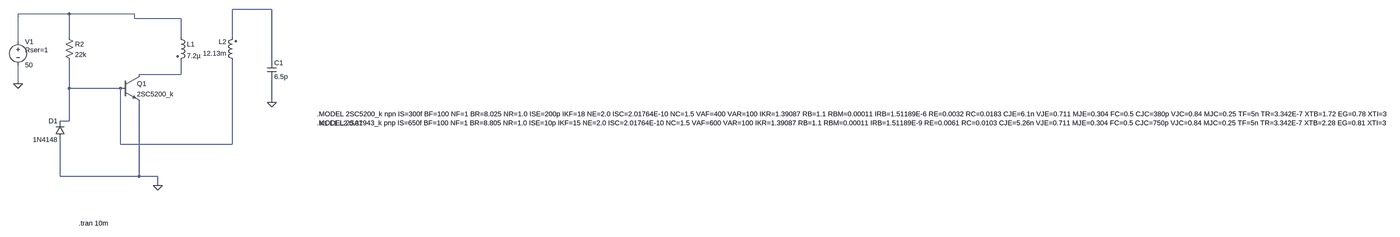
[diagram p0: schematic Tesla coil_simulation.asc, whole sheet]
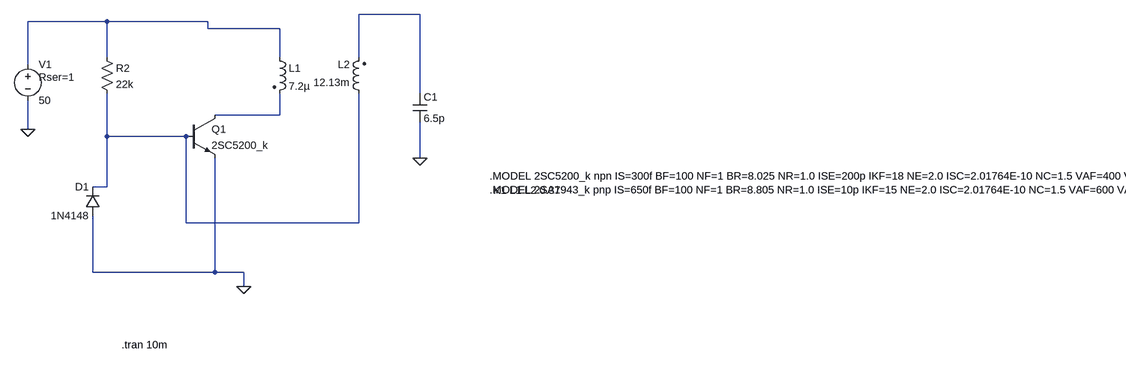
[diagram p1: schematic Tesla coil_simulation.asc, part, row 1 of 1, column 1 of 2]
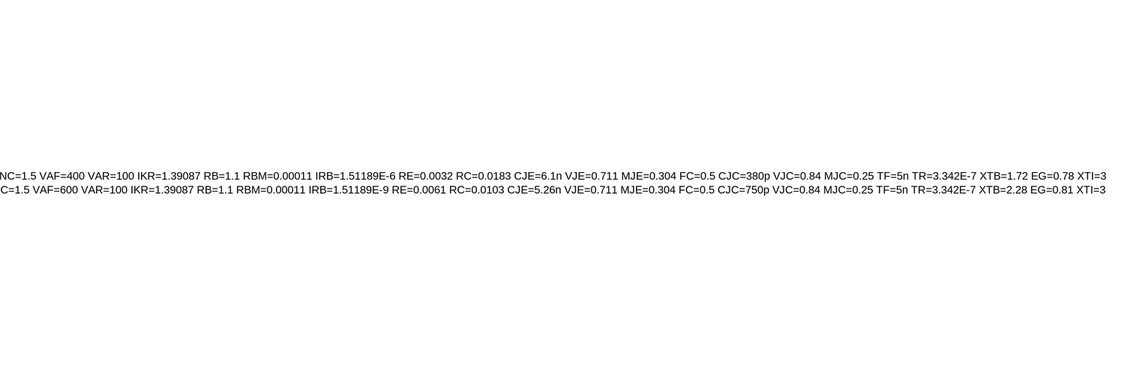
[diagram p2: schematic Tesla coil_simulation.asc, part, row 1 of 1, column 2 of 2]
Tesla coil_simulation.asc, the LTspice schematic file:
Version 4
SHEET 1 4876 680
WIRE 784 -400 640 -400
WIRE 80 -384 -96 -384
WIRE 304 -384 80 -384
WIRE 304 -368 304 -384
WIRE 464 -368 304 -368
WIRE 80 -304 80 -384
WIRE 464 -304 464 -368
WIRE 640 -304 640 -400
WIRE -96 -288 -96 -384
WIRE 784 -224 784 -400
WIRE 464 -176 464 -224
WIRE 464 -176 320 -176
WIRE -96 -144 -96 -208
WIRE 80 -128 80 -224
WIRE 256 -128 80 -128
WIRE 784 -80 784 -160
WIRE 80 -16 80 -128
WIRE 80 -16 48 -16
WIRE 256 64 256 -128
WIRE 640 64 640 -224
WIRE 640 64 256 64
WIRE 48 224 48 48
WIRE 320 224 320 -80
WIRE 320 224 48 224
WIRE 384 224 320 224
WIRE 384 256 384 224
FLAG 384 256 0
FLAG -96 -144 0
FLAG 784 -80 0
SYMBOL ind2 448 -320 R0
SYMATTR InstName L1
SYMATTR Value 7.2µ
SYMATTR Type ind
SYMBOL ind2 656 -208 R180
WINDOW 0 36 80 Left 2
WINDOW 3 36 40 Left 2
SYMATTR InstName L2
SYMATTR Value 12.13m
SYMATTR Type ind
SYMBOL diode 64 48 R180
WINDOW 0 24 64 Left 2
WINDOW 3 24 0 Left 2
SYMATTR InstName D1
SYMATTR Value 1N4148
SYMBOL cap 768 -224 R0
SYMATTR InstName C1
SYMATTR Value 6.5p
SYMBOL voltage -96 -304 R0
WINDOW 123 0 0 Left 0
WINDOW 39 24 44 Left 2
SYMATTR SpiceLine Rser=1
SYMATTR InstName V1
SYMATTR Value 50
SYMBOL npn 256 -176 R0
SYMATTR InstName Q1
SYMATTR Value 2SC5200_k
SYMBOL res 64 -320 R0
SYMATTR InstName R2
SYMATTR Value 22k
TEXT 952 -8 Left 2 !K1 L1 L2 0.37
TEXT 112 456 Left 2 !.tran 10m
TEXT 944 -40 Left 2 !.MODEL 2SC5200_k npn IS=300f BF=100 NF=1 BR=8.025 NR=1.0 ISE=200p IKF=18 NE=2.0 ISC=2.01764E-10 NC=1.5 VAF=400 VAR=100 IKR=1.39087 RB=1.1 RBM=0.00011 IRB=1.51189E-6 RE=0.0032 RC=0.0183 CJE=6.1n VJE=0.711 MJE=0.304 FC=0.5 CJC=380p VJC=0.84 MJC=0.25 TF=5n TR=3.342E-7 XTB=1.72 EG=0.78 XTI=3\n.MODEL 2SA1943_k pnp IS=650f BF=100 NF=1 BR=8.805 NR=1.0 ISE=10p IKF=15 NE=2.0 ISC=2.01764E-10 NC=1.5 VAF=600 VAR=100 IKR=1.39087 RB=1.1 RBM=0.00011 IRB=1.51189E-9 RE=0.0061 RC=0.0103 CJE=5.26n VJE=0.711 MJE=0.304 FC=0.5 CJC=750p VJC=0.84 MJC=0.25 TF=5n TR=3.342E-7 XTB=2.28 EG=0.81 XTI=3

The netlist it stands for:
* Tesla coil_simulation.asc
L1 N002 N003 7.2µ
L2 N004 N001 12.13m
D1 0 N004 1N4148
C1 N001 0 6.5p
V1 N002 0 50 Rser=1
Q1 N003 N004 0 0 2SC5200_k
R2 N002 N004 22k
.model D D
.lib standard.dio
.model NPN NPN
.model PNP PNP
.lib standard.bjt
K1 L1 L2 0.37
.tran 10m
.MODEL 2SC5200_k npn IS=300f BF=100 NF=1 BR=8.025 NR=1.0 ISE=200p IKF=18 NE=2.0 ISC=2.01764E-10 NC=1.5 VAF=400 VAR=100 IKR=1.39087 RB=1.1 RBM=0.00011 IRB=1.51189E-6 RE=0.0032 RC=0.0183 CJE=6.1n VJE=0.711 MJE=0.304 FC=0.5 CJC=380p VJC=0.84 MJC=0.25 TF=5n TR=3.342E-7 XTB=1.72 EG=0.78 XTI=3
.MODEL 2SA1943_k pnp IS=650f BF=100 NF=1 BR=8.805 NR=1.0 ISE=10p IKF=15 NE=2.0 ISC=2.01764E-10 NC=1.5 VAF=600 VAR=100 IKR=1.39087 RB=1.1 RBM=0.00011 IRB=1.51189E-9 RE=0.0061 RC=0.0103 CJE=5.26n VJE=0.711 MJE=0.304 FC=0.5 CJC=750p VJC=0.84 MJC=0.25 TF=5n TR=3.342E-7 XTB=2.28 EG=0.81 XTI=3
.backanno
.end